# Altium project Make My IMU Work Anywhere.PrjPcb
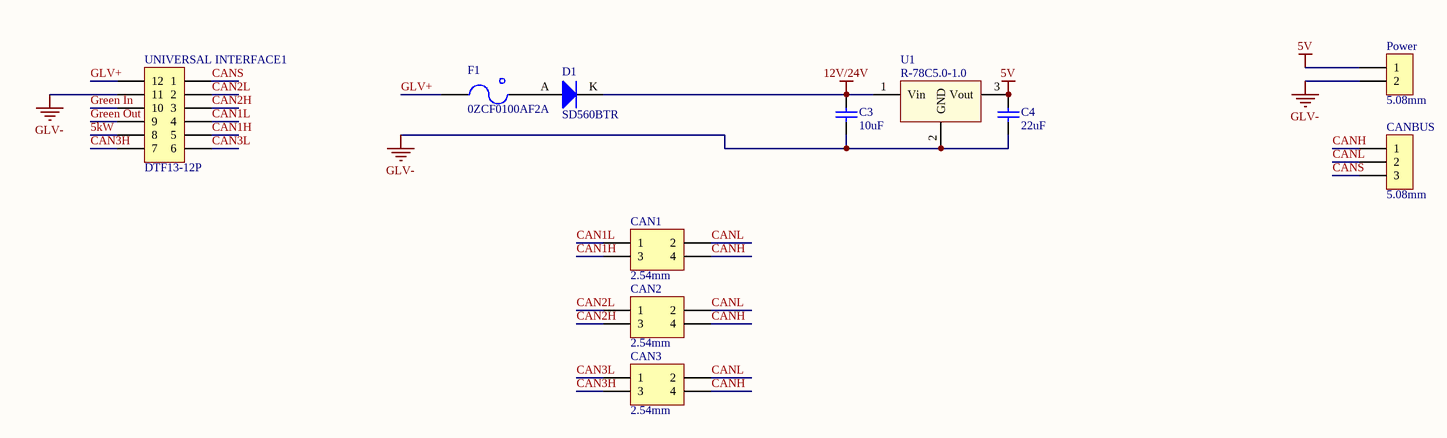
[diagram p0: Schematics.SchDoc]
1 sheet, 11 parts. Net scope: global (net labels, ports and power ports of the same name join across sheets).
Board file: PCB.PcbDoc

## Sheet Schematics.SchDoc
size A4

### Parts
C3  10uF  [0805]
C4  22uF  [1206]
CAN1  2.54mm  [TH 2.54mm Header 2x2]
CAN2  2.54mm  [TH 2.54mm Header 2x2]
CAN3  2.54mm  [TH 2.54mm Header 2x2]
CANBUS  5.08mm  [TH 5.08mm Header 1x3]
D1  SD560BTR  [SMB Diode]
F1  0ZCF0100AF2A  [2920]
Power  5.08mm  [TH 5.08mm Header 1x2]
U1  R-78C5.0-1.0  [RECOM 3-SIP]
UNIVERSAL_INTERFACE1  DTF13-12P  [DTF13-12P]

### Nets
5V: C4.2 Power.1 U1.3(Vout)
12V/24V: C3.2 D1.K U1.1(Vin)
GLV-: C3.1 C4.1 Power.2 U1.2(GND) UNIVERSAL_INTERFACE1.11
5kW: UNIVERSAL_INTERFACE1.8
CAN1H: CAN1.3 UNIVERSAL_INTERFACE1.5
CAN1L: CAN1.1 UNIVERSAL_INTERFACE1.4
CAN2H: CAN2.3 UNIVERSAL_INTERFACE1.3
CAN2L: CAN2.1 UNIVERSAL_INTERFACE1.2
CAN3H: CAN3.3 UNIVERSAL_INTERFACE1.7
CAN3L: CAN3.1 UNIVERSAL_INTERFACE1.6
CANH: CAN1.4 CAN2.4 CAN3.4 CANBUS.1
CANL: CAN1.2 CAN2.2 CAN3.2 CANBUS.2
CANS: CANBUS.3 UNIVERSAL_INTERFACE1.1
GLV+: F1.1 UNIVERSAL_INTERFACE1.12
Green In: UNIVERSAL_INTERFACE1.10
Green Out: UNIVERSAL_INTERFACE1.9
NetD1_A: D1.A F1.2

### Library data of the parts
C3 = GRM21BR6YA106KE43L: Manufacturer: muRata; Tolerance: 10%; Material: X5R; Rated Voltage: 50V; Part Number: GRM21BR6YA106KE43L; Value: 10uF; Digikey Part Number: 490-10514-6-ND
C4 = CC1206MKX5R7BB226: Manufacturer: YAGEO; Tolerance: 20%; Material: Ceramic; Rated Voltage: 16V; Part Number: CC1206MKX5R7BB226; Value: 22uF; Digikey Part Number: 311-1997-2-ND
CAN1-CAN3 = TH 2.54mm Header 2x2: Positions: 4; Angle: 0; Flange: No; Contact: NA; Part Number: TH 2.54mm Header 2x2; Pitch: 2.54mm; Row Spacing: 2.54mm
CANBUS = 1760520000: Positions: 3; Row Spacing: 0; Flange: No; Contact: NA; Part Number: 1760520000; Pitch: 5.08mm; Angle: 0; Digikey Part Number: 281-1883-ND; Digikey Link: https://www.digikey.com.au/product-detail/en/weidm%C3%BCller/1760520000/281-1883-ND/459740
D1 = SD560BTR: 1.2V_F 600V 5A SMB; Manufacturer: SMC Diode Solutions; Part Number: SD560BTR; Digikey Part Number: 1655-1530-2-ND; Digikey Link: https://www.digikey.com/product-detail/en/smc-diode-solutions/SD560BTR/1655-1530-2-ND/6022620
F1 = 0ZCF0100AF2A: PTC RESET FUSE 60V 1A 292; Manufacturer: Littelfuse Inc.; Part Number: 0ZCF0100AF2A; Digikey Part Number: 507-2070-1-ND; Digikey Link: https://www.digikey.com/product-detail/en/bel-fuse-inc/0ZCF0100AF2A/507-2070-1-ND/6210547
Power = 1760510000: Positions: 2; Row Spacing: 0; Flange: No; Contact: NA; Part Number: 1760510000; Pitch: 5.08mm; Angle: 0; Digikey Part Number: 281-1882-ND; Digikey Link: https://www.digikey.com.au/product-detail/en/weidm%C3%BCller/1760510000/281-1882-ND/459739
U1 = R-78C5.0-1.0: CONV DC/DC 1A 5V OUT SIP VERT; Manufacturer: Recom; Isolation: Non-Isolated; Part Number: R-78C5.0-1.0; Digikey Part Number: 945-1395-5-ND; Digikey Link: https://www.digikey.com.au/product-detail/en/recom-power/R-78C5.0-1.0/945-1395-5-ND/2652148
UNIVERSAL_INTERFACE1 = DTF13-12P[[/\]]DTF13-12P: Positions: 12; Pitch: 4.45mm; Angle: 90; Flange: No; Contact: Copper Alloy; Part Number: DTF13-12P; Row Spacing: 4.45mm; Digikey Part Number: 1734-1861-ND; Digikey Link: https://www.digikey.com/products/en?keywords=dtf13-12pa